# EAGLE design DESIGN7ES (EAGLE 9.6.1)
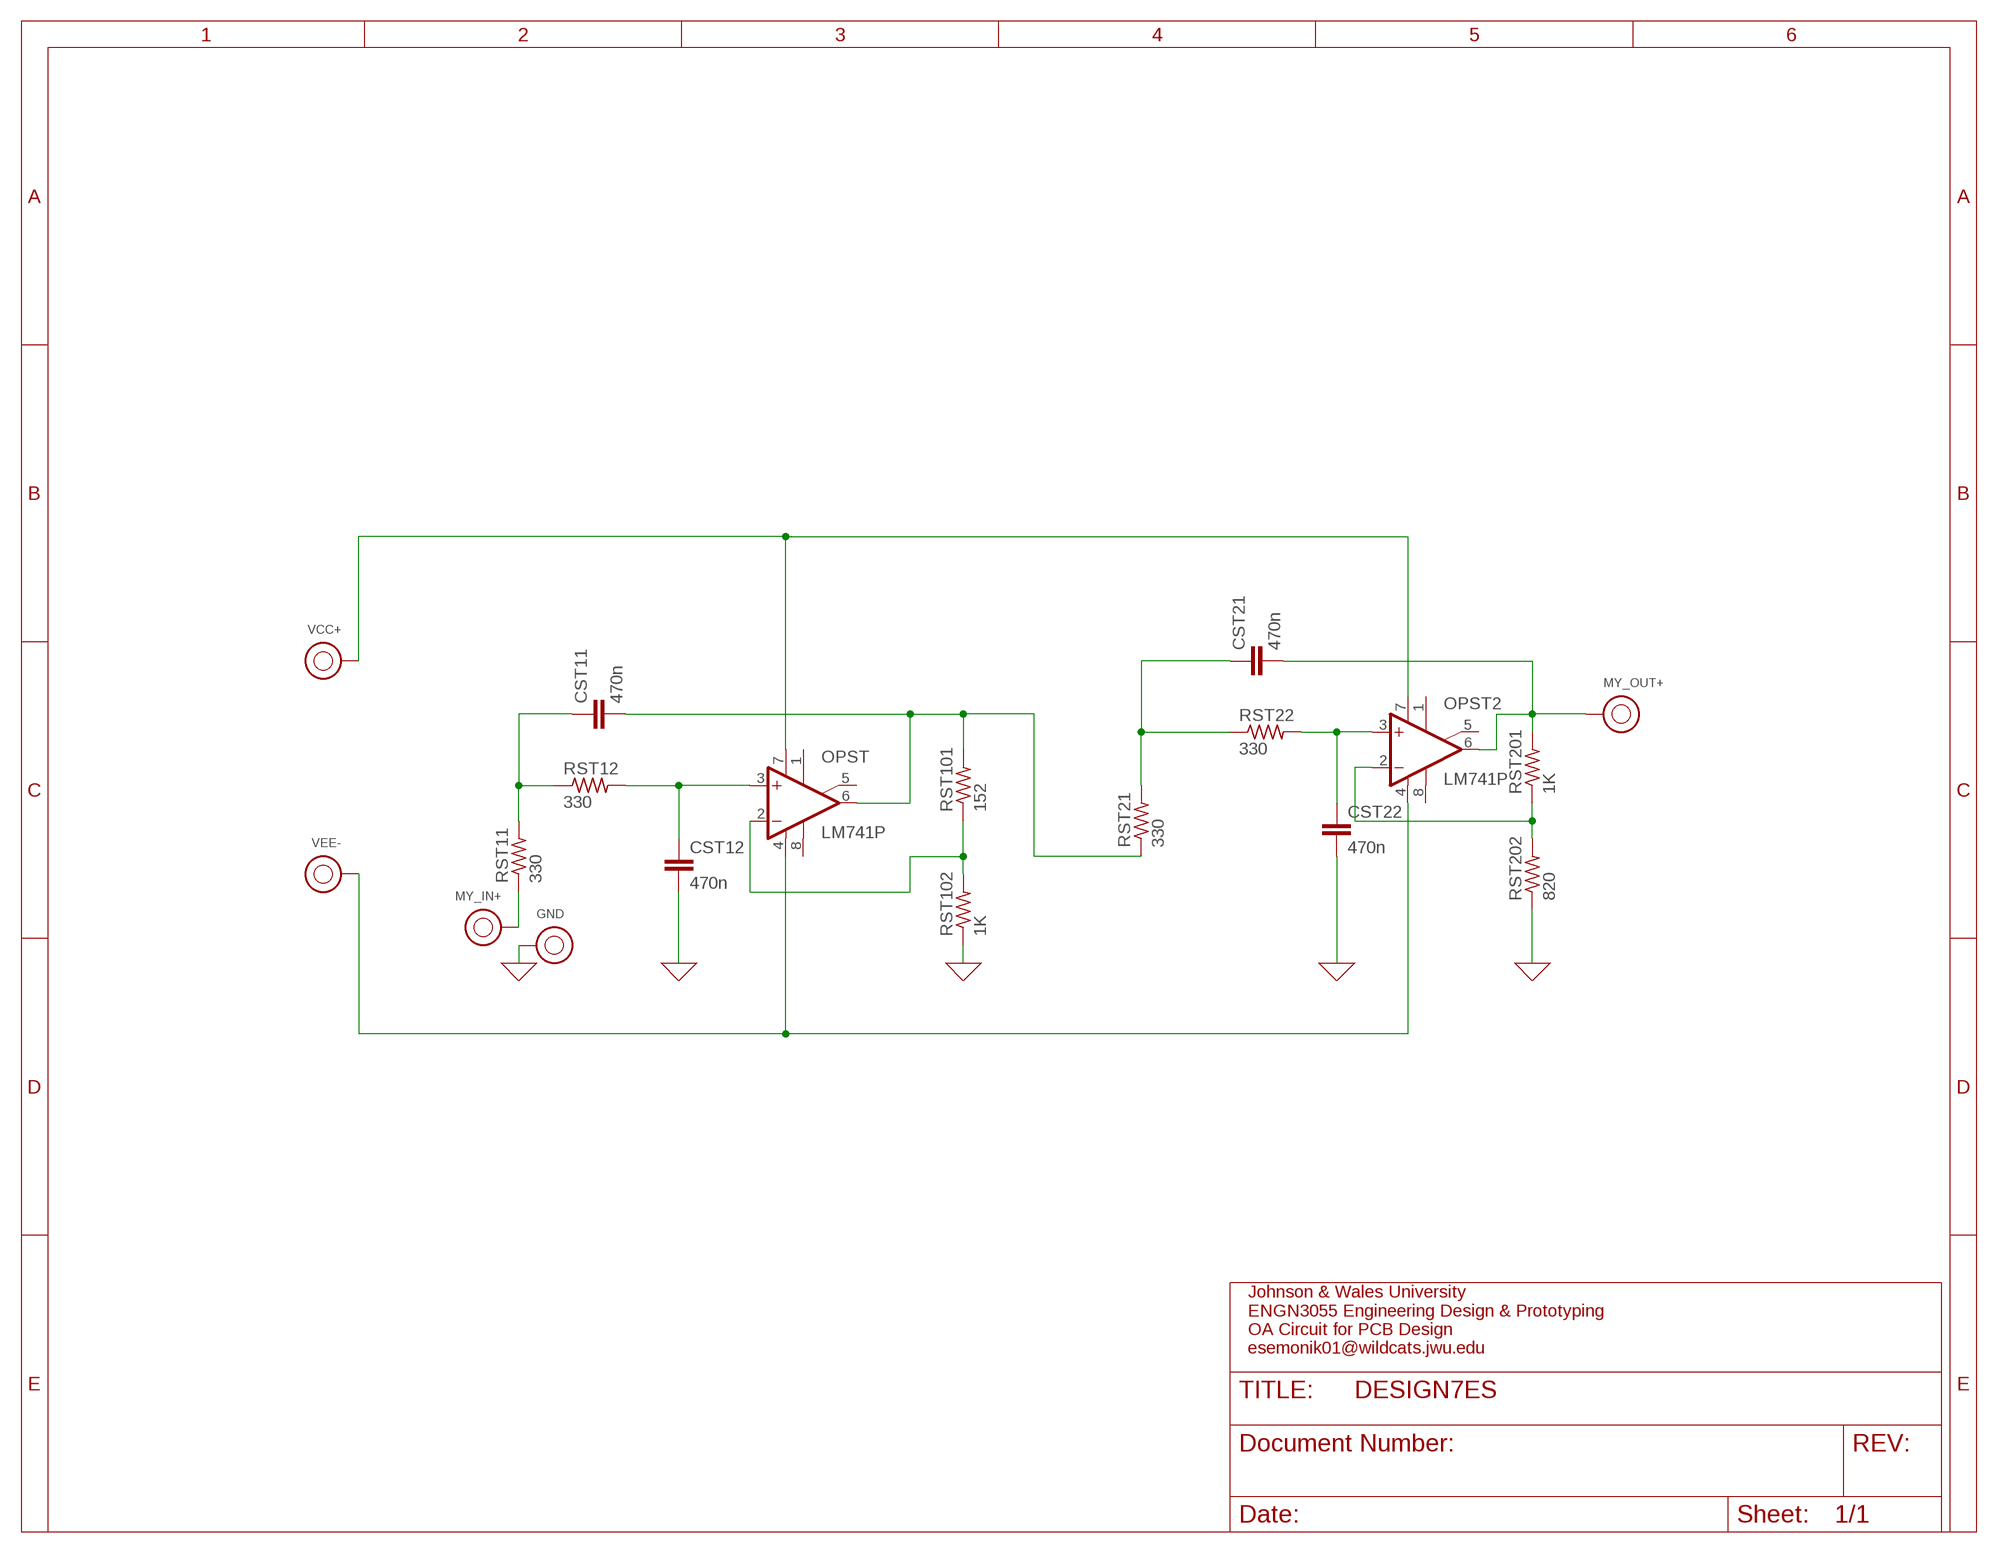
[diagram p0: schematic, sheet 1]

## Parts
CST11  470n  C2.5/2  [C2.5-2]
CST12  470n  C2.5/2  [C2.5-2]
CST21  470n  C2.5/2  [C2.5-2]
CST22  470n  C2.5/2  [C2.5-2]
GND  BINDING-POST  [BINDING-POST]
MY_IN+  BINDING-POST  [BINDING-POST]
MY_OUT+  BINDING-POST  [BINDING-POST]
OPST  LM741P  [DIL08]
OPST2  LM741P  [DIL08]
RST11  330  R-US_0204/5  [0204/5]
RST12  330  R-US_0204/5  [0204/5]
RST21  330  R-US_0204/5  [0204/5]
RST22  330  R-US_0204/5  [0204/5]
RST101  152  R-US_0204/5  [0204/5]
RST102  1K  R-US_0204/5  [0204/5]
RST201  1K  R-US_0204/5  [0204/5]
RST202  820  R-US_0204/5  [0204/5]
VCC+  BINDING-POST  [BINDING-POST]
VEE-  BINDING-POST  [BINDING-POST]

## Nets
0: CST12.2 CST22.2 GND.1 GND.1_1 GND.1_2 GND.1_3 GND.1_4 GND.1_5 GND.1_6 GND.1_7 GND.1_8 RST102.1 RST202.1 ; supply symbol labelled GND
N$1: CST11.1 RST11.2 RST12.1
N$2: CST12.1 OPST.3(+IN) RST12.2
N$3: OPST.2(-IN) RST101.1 RST102.2
N$4: CST11.2 OPST.6(OUT) RST21.1 RST101.2
N$5: OPST2.2(-IN) RST201.1 RST202.2
N$6: CST21.1 RST21.2 RST22.1
N$7: CST22.1 OPST2.3(+IN) RST22.2
N$8: CST21.2 MY_OUT+.1 MY_OUT+.1_1 MY_OUT+.1_2 MY_OUT+.1_3 MY_OUT+.1_4 MY_OUT+.1_5 MY_OUT+.1_6 MY_OUT+.1_7 MY_OUT+.1_8 OPST2.6(OUT) RST201.2
N$9: MY_IN+.1 MY_IN+.1_1 MY_IN+.1_2 MY_IN+.1_3 MY_IN+.1_4 MY_IN+.1_5 MY_IN+.1_6 MY_IN+.1_7 MY_IN+.1_8 RST11.1
N$10: OPST2.7(V+) OPST.7(V+) VCC+.1 VCC+.1_1 VCC+.1_2 VCC+.1_3 VCC+.1_4 VCC+.1_5 VCC+.1_6 VCC+.1_7 VCC+.1_8
N$12: OPST2.4(V-) OPST.4(V-) VEE-.1 VEE-.1_1 VEE-.1_2 VEE-.1_3 VEE-.1_4 VEE-.1_5 VEE-.1_6 VEE-.1_7 VEE-.1_8
Unconnected: OPST2.1(ON1) OPST2.5(ON2) OPST2.8(OPT) OPST.1(ON1) OPST.5(ON2) OPST.8(OPT)

## Notes on the sheet
- Johnson & Wales University
  ENGN3055 Engineering Design & Prototyping
  OA Circuit for PCB Design
  esemonik01@wildcats.jwu.edu

## Library data of the parts
CST11 CST12 CST21 CST22 = capacitor-wima:C: CAPACITOR naming: grid - package width
GND MY_IN+ MY_OUT+ VCC+ VEE- = binding-post_10:BINDING-POST: Binding post
OPST OPST2 = linear4:*741: OP AMP
RST11 RST12 RST21 RST22 RST101 RST102 RST201 RST202 = rcl:R-US_: RESISTOR, American symbol; SPICEPREFIX: R

## Board
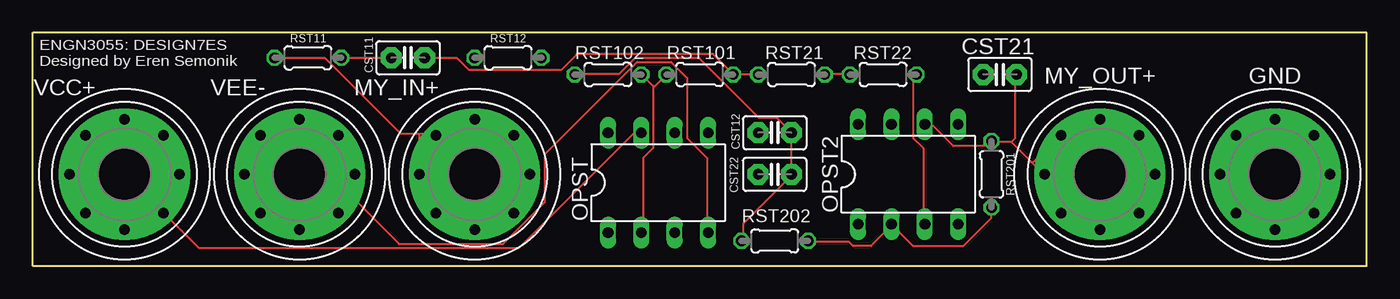
[diagram p1: board, top side]
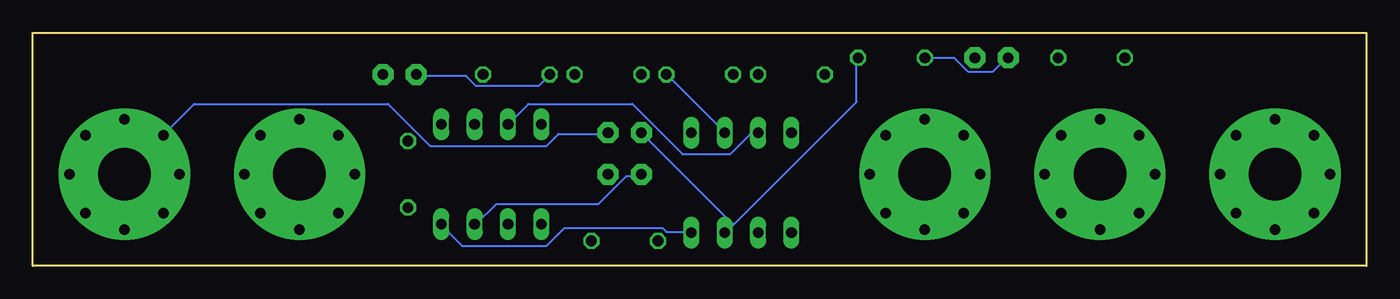
[diagram p2: board, bottom side, seen from below]

Size 101.6 x 17.78 mm. Coordinates in mm from the lower left corner, seen from the top.
Outline: 0,0 0,17.78 101.6,17.78 101.6,0 0,0
Copper layers (1*16): Top 0.035559375mm / dielectric 1.6mm / Bottom 0.035559375mm
Design rules "oshpark-2layer": minimum track width 6mil, minimum drill 10mil, track to track 6mil, track to pad 6mil, pad to pad 6mil, via to via 6mil, smd to smd 6mil, copper to edge 15mil, drill to drill 6mil, minimum pad ring 5mil, minimum via ring 5mil, stop-mask expansion 2.5mil, vias tented up to drill 0mil, thermal gap 10mil

### Footprints (pad centres in the part's own frame; a part is rotated, then mirrored left to right if it is on the bottom)
C2.5-2 = drill 0.813 pad 1.6 octagon: 1 -1.27,0; 2 1.27,0
BINDING-POST = drill 4 pad 10: 1 0,0 | drill 0.8 pad 0.9: 1_1 4.2,0; 1_2 2.97,2.97; 1_3 0,4.2; 1_4 -2.97,2.97; 1_5 -4.2,0; 1_6 -2.97,-2.97; 1_7 0,-4.2; 1_8 2.97,-2.97
DIL08 = drill 0.813 long: 1 -3.81,-3.81; 2 -1.27,-3.81; 3 1.27,-3.81; 4 3.81,-3.81; 5 3.81,3.81; 6 1.27,3.81; 7 -1.27,3.81; 8 -3.81,3.81
0204/5 = drill 0.813 octagon: 1 -2.54,0; 2 2.54,0

### Placement (x,y rotation side)
CST11  28.57,15.88 0 top
CST12  56.52,10.16 0 top
CST21  73.66,14.61 0 top
CST22  56.52,6.99 0 top
GND  94.61,6.99 0 top
MY_IN+  33.66,6.99 0 top
MY_OUT+  81.28,6.99 0 top
OPST  47.62,6.35 0 top
OPST2  66.67,6.99 0 top
RST11  20.95,15.88 0 top
RST12  36.2,15.88 0 top
RST21  57.78,14.61 0 top
RST22  64.77,14.61 0 top
RST101  50.8,14.61 0 top
RST102  43.81,14.61 0 top
RST201  73.03,6.99 90 top
RST202  56.52,1.91 0 top
VCC+  6.99,6.99 0 top
VEE-  20.32,6.99 0 top

### Tracks (layer width: path | path; a pad name or v marks a point on that pad's centre or on a via)
0
  Top 0.152: RST202.1 54.1,1.98 54.1,3.2 57.76,6.86 CST22.2 57.76,7.01 57.76,10.06 CST12.2 57.76,10.21 56.69,11.28 55.32,11.28 50.75,15.85 45.87,15.85 44.65,14.63 41.3,14.63 RST102.1 | GND.1_4 91.75,10.06 93.42,10.06 94.49,11.12 GND.1_3 94.64,11.12 95.71,10.06 97.54,10.06 GND.1_2 97.69,9.91 97.69,8.08 98.75,7.01 GND.1_1 98.75,6.86 97.69,5.79 97.69,4.12 GND.1_8 97.54,3.96 95.71,3.96 94.64,2.9 GND.1_7 94.49,2.9 92.81,2.9 91.75,3.96 GND.1_6 91.59,4.12 91.59,5.79 | 91.59,5.79 90.53,6.86 GND.1_5 | 91.59,5.79 93.42,5.79 GND.1
  Bottom 0.152: CST12.2 57.91,10.06 61.57,10.06 62.48,9.14 71.32,9.14 74.52,12.34 89.31,12.34 91.59,10.06 GND.1_4
N$1
  Top 0.152: RST11.2 23.62,15.85 27.28,15.85 CST11.1
  Bottom 0.152: RST12.1 33.53,15.85 31.39,15.85 30.33,14.78 28.5,14.78 27.43,15.85 CST11.1
N$2
  Bottom 0.152: 48.16,3.2 48.77,2.59 OPST.3 | 48.16,3.2 38.86,12.5 38.86,15.85 RST12.2 | 48.16,3.2 48.31,3.2 55.17,10.06 CST12.1
N$3
  Top 0.152: 47.24,13.56 47.24,13.72 RST102.2 | 47.24,13.56 47.24,8.99 46.48,8.23 46.48,2.59 OPST.2 | 47.24,13.56 48.16,14.48 RST101.1
N$4
  Top 0.152: 53.34,14.63 55.17,14.63 RST21.1 | 53.34,14.63 51.82,16.15 41.45,16.15 40.23,14.94 33.22,14.94 32.31,15.85 29.87,15.85 CST11.2 | 53.34,14.63 RST101.2
  Bottom 0.152: OPST.6 48.92,10.21 53.34,14.63 RST101.2
N$5
  Top 0.152: RST202.2 59.13,1.83 62.18,1.83 62.48,1.52 63.86,1.52 65.38,3.05 OPST2.2 67.06,1.52 70.87,1.52 73,3.66 73,4.42 RST201.1
N$6
  Top 0.152: RST21.2 60.35,14.63 62.18,14.63 RST22.1
  Bottom 0.152: CST21.1 72.39,14.48 68.58,14.48 67.82,13.72 63.09,13.72 62.33,14.48 RST22.1
N$7
  Top 0.152: OPST2.3 67.82,3.2 67.82,8.99 67.06,9.75 67.06,14.33 67.21,14.48 RST22.2
  Bottom 0.152: CST22.1 55.32,6.86 56.39,6.86 58.52,4.72 66.29,4.72 67.82,3.2 OPST2.3
N$8
  Top 0.152: MY_OUT+.1_7 81.38,2.9 83.06,2.9 84.12,3.96 MY_OUT+.1_8 84.28,4.12 85.34,5.18 85.34,6.86 MY_OUT+.1_1 85.34,7.01 85.34,8.84 84.28,9.91 MY_OUT+.1_2 84.12,10.06 82.45,10.06 81.38,11.12 MY_OUT+.1_3 81.23,11.12 80.16,10.06 | 80.16,10.06 78.33,10.06 MY_OUT+.1_4 78.18,9.91 76.2,7.92 76.05,7.92 | MY_OUT+.1_6 78.18,4.12 77.11,5.18 77.11,6.86 MY_OUT+.1_5 76.96,7.01 76.05,7.92 | 74.52,9.45 73.15,9.45 RST201.2 73,9.45 72.69,9.14 70.1,9.14 68.58,10.67 67.97,10.67 OPST2.6 | 76.05,7.92 74.52,9.45 | 74.52,9.45 74.83,9.75 74.83,14.48 CST21.2 | 80.16,10.06 80.16,8.08 81.23,7.01 MY_OUT+.1
N$9
  Top 0.152: MY_IN+.1_1 37.8,6.86 36.73,5.79 36.73,4.12 MY_IN+.1_8 36.58,3.96 34.75,3.96 33.68,2.9 MY_IN+.1_7 33.53,2.9 31.85,2.9 30.79,3.96 MY_IN+.1_6 30.63,4.12 30.63,5.79 | 30.63,5.79 29.57,6.86 MY_IN+.1_5 29.41,7.01 29.41,10.06 | MY_IN+.1_2 36.58,10.06 34.75,10.06 33.68,11.12 MY_IN+.1_3 33.53,11.12 32.46,10.06 30.79,10.06 MY_IN+.1_4 30.63,10.06 29.41,10.06 | 29.41,10.06 28.04,10.06 22.25,15.85 18.44,15.85 RST11.1 | 30.63,5.79 32.46,5.79 MY_IN+.1
N$10
  Top 0.152: VCC+.1_4 4.12,10.06 5.79,10.06 6.86,11.12 VCC+.1_3 7.01,11.12 8.08,10.06 9.91,10.06 VCC+.1_2 10.06,9.91 10.06,8.08 11.12,7.01 VCC+.1_1 11.12,6.86 10.06,5.79 10.06,4.12 VCC+.1_8 | VCC+.1_5 2.9,6.86 2.9,5.18 3.96,4.12 VCC+.1_6 4.12,3.96 5.18,2.9 6.86,2.9 VCC+.1_7 7.01,2.9 8.08,3.96 | 8.08,3.96 9.91,3.96 VCC+.1_8 | 8.08,3.96 8.08,5.79 7.01,6.86 VCC+.1 | OPST.7 46.33,10.06 45.72,10.06 37.03,1.37 12.65,1.37 10.06,3.96 VCC+.1_8
  Bottom 0.152: OPST2.7 63.86,12.34 55.93,12.34 52.12,8.53 48.46,8.53 46.94,10.06 46.48,10.06 OPST.7
N$12
  Top 0.152: VEE-.1_7 20.42,2.9 22.1,2.9 23.16,3.96 VEE-.1_8 23.32,4.12 24.38,5.18 | 24.38,5.18 24.38,6.86 VEE-.1_1 24.38,7.01 24.38,8.84 23.32,9.91 VEE-.1_2 23.16,10.06 21.49,10.06 20.42,11.12 VEE-.1_3 20.27,11.12 19.2,10.06 | VEE-.1_6 17.22,4.12 16.15,5.18 16.15,6.86 VEE-.1_5 16.15,7.01 16.15,8.84 17.22,9.91 VEE-.1_4 17.37,10.06 19.2,10.06 | 19.2,10.06 19.2,8.08 20.27,7.01 VEE-.1 24.38,5.18 | 24.38,5.18 27.89,1.68 35.81,1.68 39.01,4.88 39.01,8.53 46.02,15.54 48.62,15.54 49.84,14.33 49.84,9.75 51.36,8.23 51.36,2.59 OPST.4
  Bottom 0.152: OPST.4 51.51,2.59 53.34,2.59 53.65,2.9 61.11,2.9 62.48,1.52 68.89,1.52 70.41,3.05 OPST2.4

### Text on the board
tNames: ENGN3055: DESIGN7ES / Designed by Eren Semonik